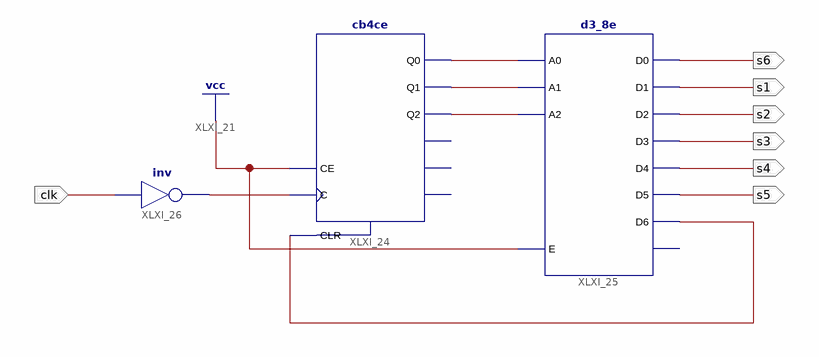
[diagram p0: schematic sheet 1]
// Xilinx ISE schematic stepper.sch (aspartan6) as structural Verilog: 3 symbols, 7 ports
module stepper (
  input  clk,
  output s5,
  output s4,
  output s3,
  output s2,
  output s1,
  output s6
);

  wire XLXN_18, XLXN_19, XLXN_20, XLXN_22, XLXN_23;

  cb4ce XLXI_24 (.C(XLXN_23), .CE(1'b1), .CLR(XLXN_22), .Q0(XLXN_18), .Q1(XLXN_19), .Q2(XLXN_20));  // open: CEO, Q3, TC
  d3_8e XLXI_25 (
    .A0(XLXN_18), .A1(XLXN_19), .A2(XLXN_20), .E(1'b1), .D0(s6), .D1(s1), .D2(s2), .D3(s3), .D4(s4), .D5(s5),
    .D6(XLXN_22));  // open: D7
  not XLXI_26 (XLXN_23, clk);
endmodule
